# Altium schematic sheet cd_switching.SchDoc: Power Side
size A3; SheetNumber: 1; SheetTotal: 6
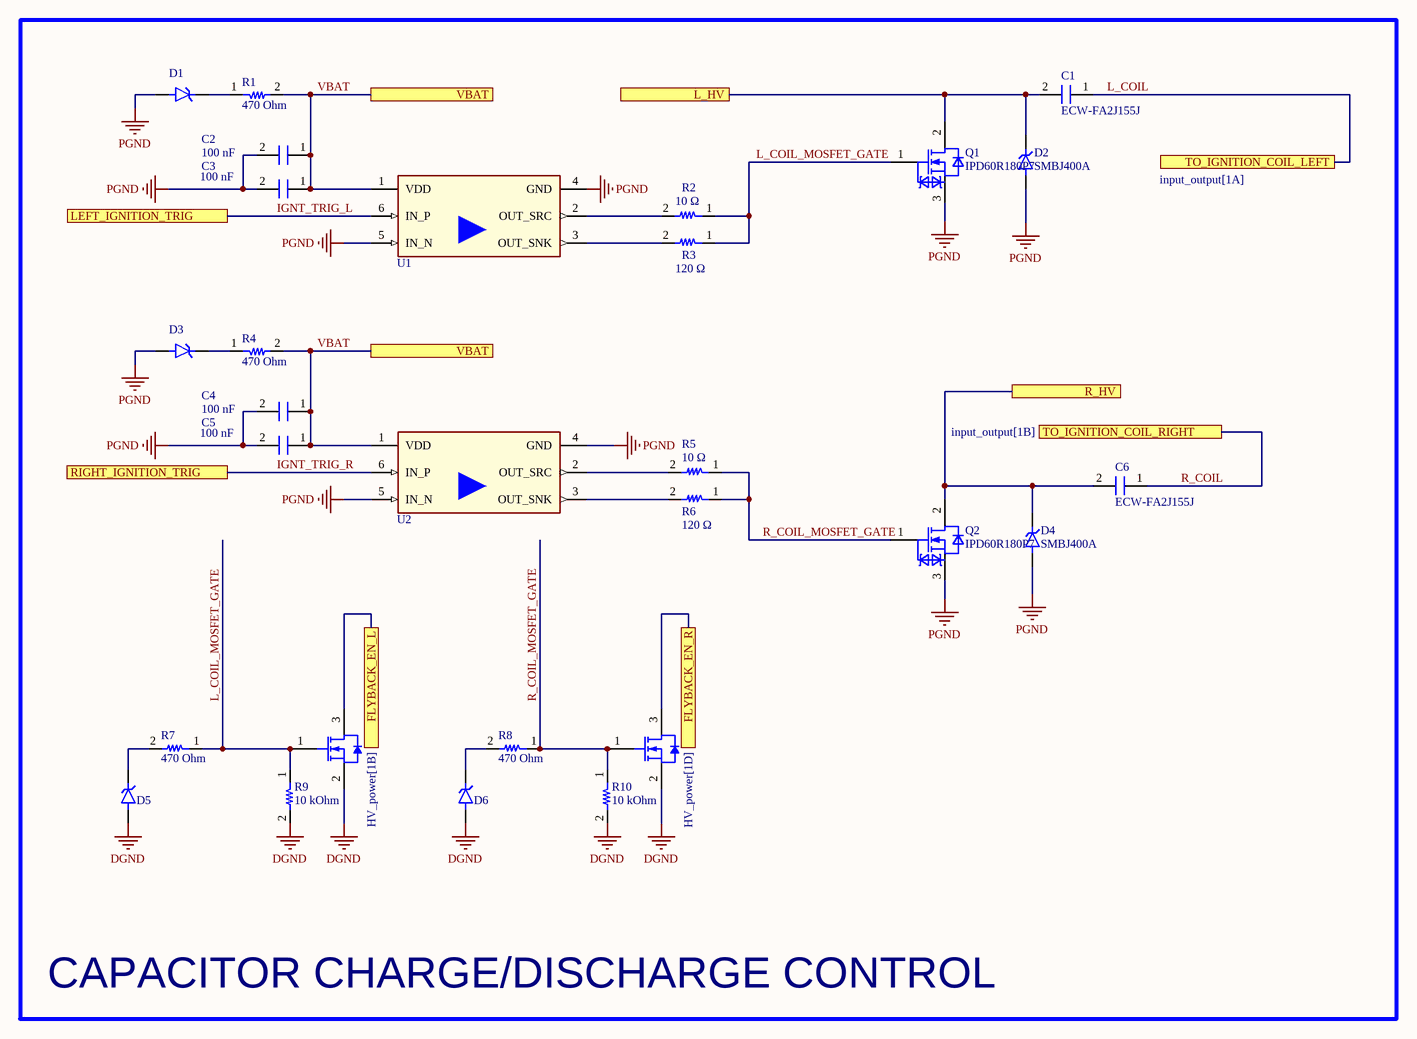
[diagram p0: cd_switching.SchDoc]

## Parts
C1  ECW-FA2J155J  [22,5mm_CAP]
C2  value 100 nF  [0603_FP]  (hidden comment: Capacitor_0603)
C3  value 100 nF  [0603_FP]  (hidden comment: Capacitor_0603)
C4  value 100 nF  [0603_FP]  (hidden comment: Capacitor_0603)
C5  value 100 nF  [0603_FP]  (hidden comment: Capacitor_0603)
C6  ECW-FA2J155J  [22,5mm_CAP]
D1  BZT52B15SH_RRG  [DIO_BZT52B15SH_RRG]  (value not drawn)
D2  SMBJ400A  [DIOM5436X261N]
D3  BZT52B15SH_RRG  [DIO_BZT52B15SH_RRG]  (value not drawn)
D4  SMBJ400A  [DIOM5436X261N]
D5  BZT52B15SH_RRG  [DIO_BZT52B15SH_RRG]  (value not drawn)
D6  BZT52B15SH_RRG  [DIO_BZT52B15SH_RRG]  (value not drawn)
Q1  IPD60R180P7  [DPAK228P987X240-3N]
Q2  IPD60R180P7  [DPAK228P987X240-3N]
Q3  MGSF1N03LT1G  [ONSC-SOT-23-3-318-08_V]  (value not drawn)
Q4  MGSF1N03LT1G  [ONSC-SOT-23-3-318-08_V]  (value not drawn)
R1  value 470 Ohm  [0603_FP]  (hidden comment: Resistor_0603)
R2  value 10 Ω  [0603_FP]  (hidden comment: Resistor_0603)
R3  value 120 Ω  [0603_FP]  (hidden comment: Resistor_0603)
R4  value 470 Ohm  [0603_FP]  (hidden comment: Resistor_0603)
R5  value 10 Ω  [0603_FP]  (hidden comment: Resistor_0603)
R6  value 120 Ω  [0603_FP]  (hidden comment: Resistor_0603)
R7  value 470 Ohm  [0603_FP]  (hidden comment: Resistor_0603)
R8  value 470 Ohm  [0603_FP]  (hidden comment: Resistor_0603)
R9  value 10 kOhm  [0402_fp]  (hidden comment: Resistor_0402)
R10  value 10 kOhm  [0402_fp]  (hidden comment: Resistor_0402)
U1  1EDN7511B  [SOT95P280X145-6N-7-V]  (value not drawn)
U2  1EDN7511B  [SOT95P280X145-6N-7-V]  (value not drawn)

## Blocks framed on the sheet
CAPACITOR CHARGE/DISCHARGE CONTROL: C1-C6 D1-D6 Q1-Q4 R1-R10 U1 U2

## Ports
FLYBACK_EN_L (see HV_power[1B]), FLYBACK_EN_R (see HV_power[1D]), L_HV (see HV_power[4A]), LEFT_IGNITION_TRIG (see logic[1A]), R_HV (see HV_power[4B]), RIGHT_IGNITION_TRIG (see logic[1B]), TO_IGNITION_COIL_LEFT (see input_output[1A]), TO_IGNITION_COIL_RIGHT (see input_output[1B]), VBAT (see cd_switching[3A], HV_power[1A], HV_power[1C], input_output[2D], LV_power[1B]), VBAT (see cd_switching[3B], HV_power[1A], HV_power[1C], input_output[2D], LV_power[1B])

## Nets
DGND: D5.2(A) D6.2(A) Q3.2(S) Q4.2(S) R9.2 R10.2
PGND: C2.2 C3.2 C4.2 C5.2 D1.2(A) D2.2(A) D3.2(A) D4.2(A) Q1.3(SOURCE) Q2.3(SOURCE) U1.4(GND) U1.5(IN_N) U2.4(GND) U2.5(IN_N)
FLYBACK_EN_L: Q3.3(D) ; port FLYBACK_EN_L
FLYBACK_EN_R: Q4.3(D) ; port FLYBACK_EN_R
IGNT_TRIG_L: U1.6(IN_P) ; port LEFT_IGNITION_TRIG
IGNT_TRIG_R: U2.6(IN_P) ; port RIGHT_IGNITION_TRIG
L_COIL: C1.1 ; port TO_IGNITION_COIL_LEFT
L_COIL_MOSFET_GATE: Q1.1(GATE) Q3.1(G) R2.1 R3.1 R7.1 R9.1
L_HV: C1.2 D2.1(K) Q1.2(DRAIN) ; port L_HV
R_COIL: C6.1 ; port TO_IGNITION_COIL_RIGHT
R_COIL_MOSFET_GATE: Q2.1(GATE) Q4.1(G) R5.1 R6.1 R8.1 R10.1
R_HV: C6.2 D4.1(K) Q2.2(DRAIN) ; port R_HV
VBAT: C2.1 C3.1 C4.1 C5.1 R1.2 R4.2 U1.1(VDD) U2.1(VDD) ; port VBAT
NetD1_1: D1.1(K) R1.1
NetD3_1: D3.1(K) R4.1
NetD5_1: D5.1(K) R7.2
NetD6_1: D6.1(K) R8.2
NetR2_2: R2.2 U1.2(OUT_SRC)
NetR3_2: R3.2 U1.3(OUT_SNK)
NetR5_2: R5.2 U2.2(OUT_SRC)
NetR6_2: R6.2 U2.3(OUT_SNK)

## Library data of the parts
C1 C6 = Capacitor_THT_22.5mm
C2-C5 = Capacitor_0603: Format: 0402; Package: 0402
D1 D3 D5 D6 = BZT52B15SH_RRG: SOD-323, 200mW, 2%, 15V, Zener Diode; MF: Taiwan Semiconductor Corporation; MP: BZT52B15SH RRG; SnapEDA_Link: https://www.snapeda.com/parts/BZT52B15SH%20RRG/Taiwan+Semiconductor+Corporation/view-part/?ref=snap; Package: SOD-323-2 Taiwan Semiconductor; Value: *; Check_prices: https://www.snapeda.com/parts/BZT52B15SH%20RRG/Taiwan+Semiconductor+Corporation/view-part/?ref=eda
D2 D4 = SMBJ400A: Pince 648V 900mA Ipp TVS Diode Surface Mount DO-214AA (SMBJ); MF: Littelfuse; SnapEDA_Link: https://www.snapeda.com/parts/SMBJ400A/Littelfuse/view-part/?ref=snap; Package: DO-214 Littelfuse; Value: *; MP: SMBJ400A; Check_prices: https://www.snapeda.com/parts/SMBJ400A/Littelfuse/view-part/?ref=eda
Q1 Q2 = IPD60R180P7: Insulated-Gate Field-Effect Transistor (IGFET), N-Channel, Enhancement, Body Diode, ESD Diode Gate/Source, Pin 1 Gate, 2 Drain, 3 Source, 3 Pins; Manufacturer: Infineon Technologies; PackageReference: PG-TO252-3-342; Manufacturer Order Number: IPD60R180P7
Q3 Q4 = CMP-1058-00778-1: Power MOSFET, 30 V, 2.1 A, Single N-Channel, 3-Pin SOT-23, Pb-Free, Tape and Reel; Manufacturer: On Semiconductor; VGS(th) Max (V): 2.4; Channel Polarity: N Channel; Ciss Typ (pF): 140; Crss Typ (pF): 40; Coss Typ (pF): 100; V(BR)DSS Min (V): 30; ID Max (A): 2.1; VGS Max (V): 20; ComponentLink1Description: Manufacturer URL; PartNumber: MGSF1N03LT1G; Packing: Tape and Reel; DatasheetVersion: Rev. 10; ComponentLink1URL: http://www.onsemi.com/; Mounting Technology: Surface Mount; PackageVersion: Rev. AP, 11/2009; PackageDescription: 3-Pin Small Outline Transistor, Body 2.92 x 1.3 mm, Pitch 0.95 mm; Package Type: SOT-23-3; ComponentLink3URL: http://www.onsemi.cn/pub_link/Collateral/318-08.PDF; RoHS: Pb-Free; ComponentLink3Description: Package Specification; ComponentLink2Description: Datasheet; Configuration: Single; PackageReference: SOT-23-3-318-08; ComponentLink2URL: http://www.onsemi.cn/pub_link/Collateral/MGSF1N03LT1-D.PDF
R1-R8 = Resistor_0603: Format: 0402; Package: 0402
R9 R10 = Resistor_0402: Format: 0402; Package: 0402
U1 U2 = 1EDN7511B: EiceDRIVER, Fast Single Channel 4A/8A Low-Side Gate Driver, UVLO - 4.2V; Manufacturer: Infineon Technologies; ManufacturerPartNumber: 1EDN7511B; PackageReference: PG-SOT23-6-2